# EAGLE design cactusCup_v2 (EAGLE 8.3.2)
A micro-controller designed to fit into an express card slot and become an integrated part of the computer
COMPANY: ADAFRUIT INDUSTRIES; DRAWN: KTOWN; REV: B
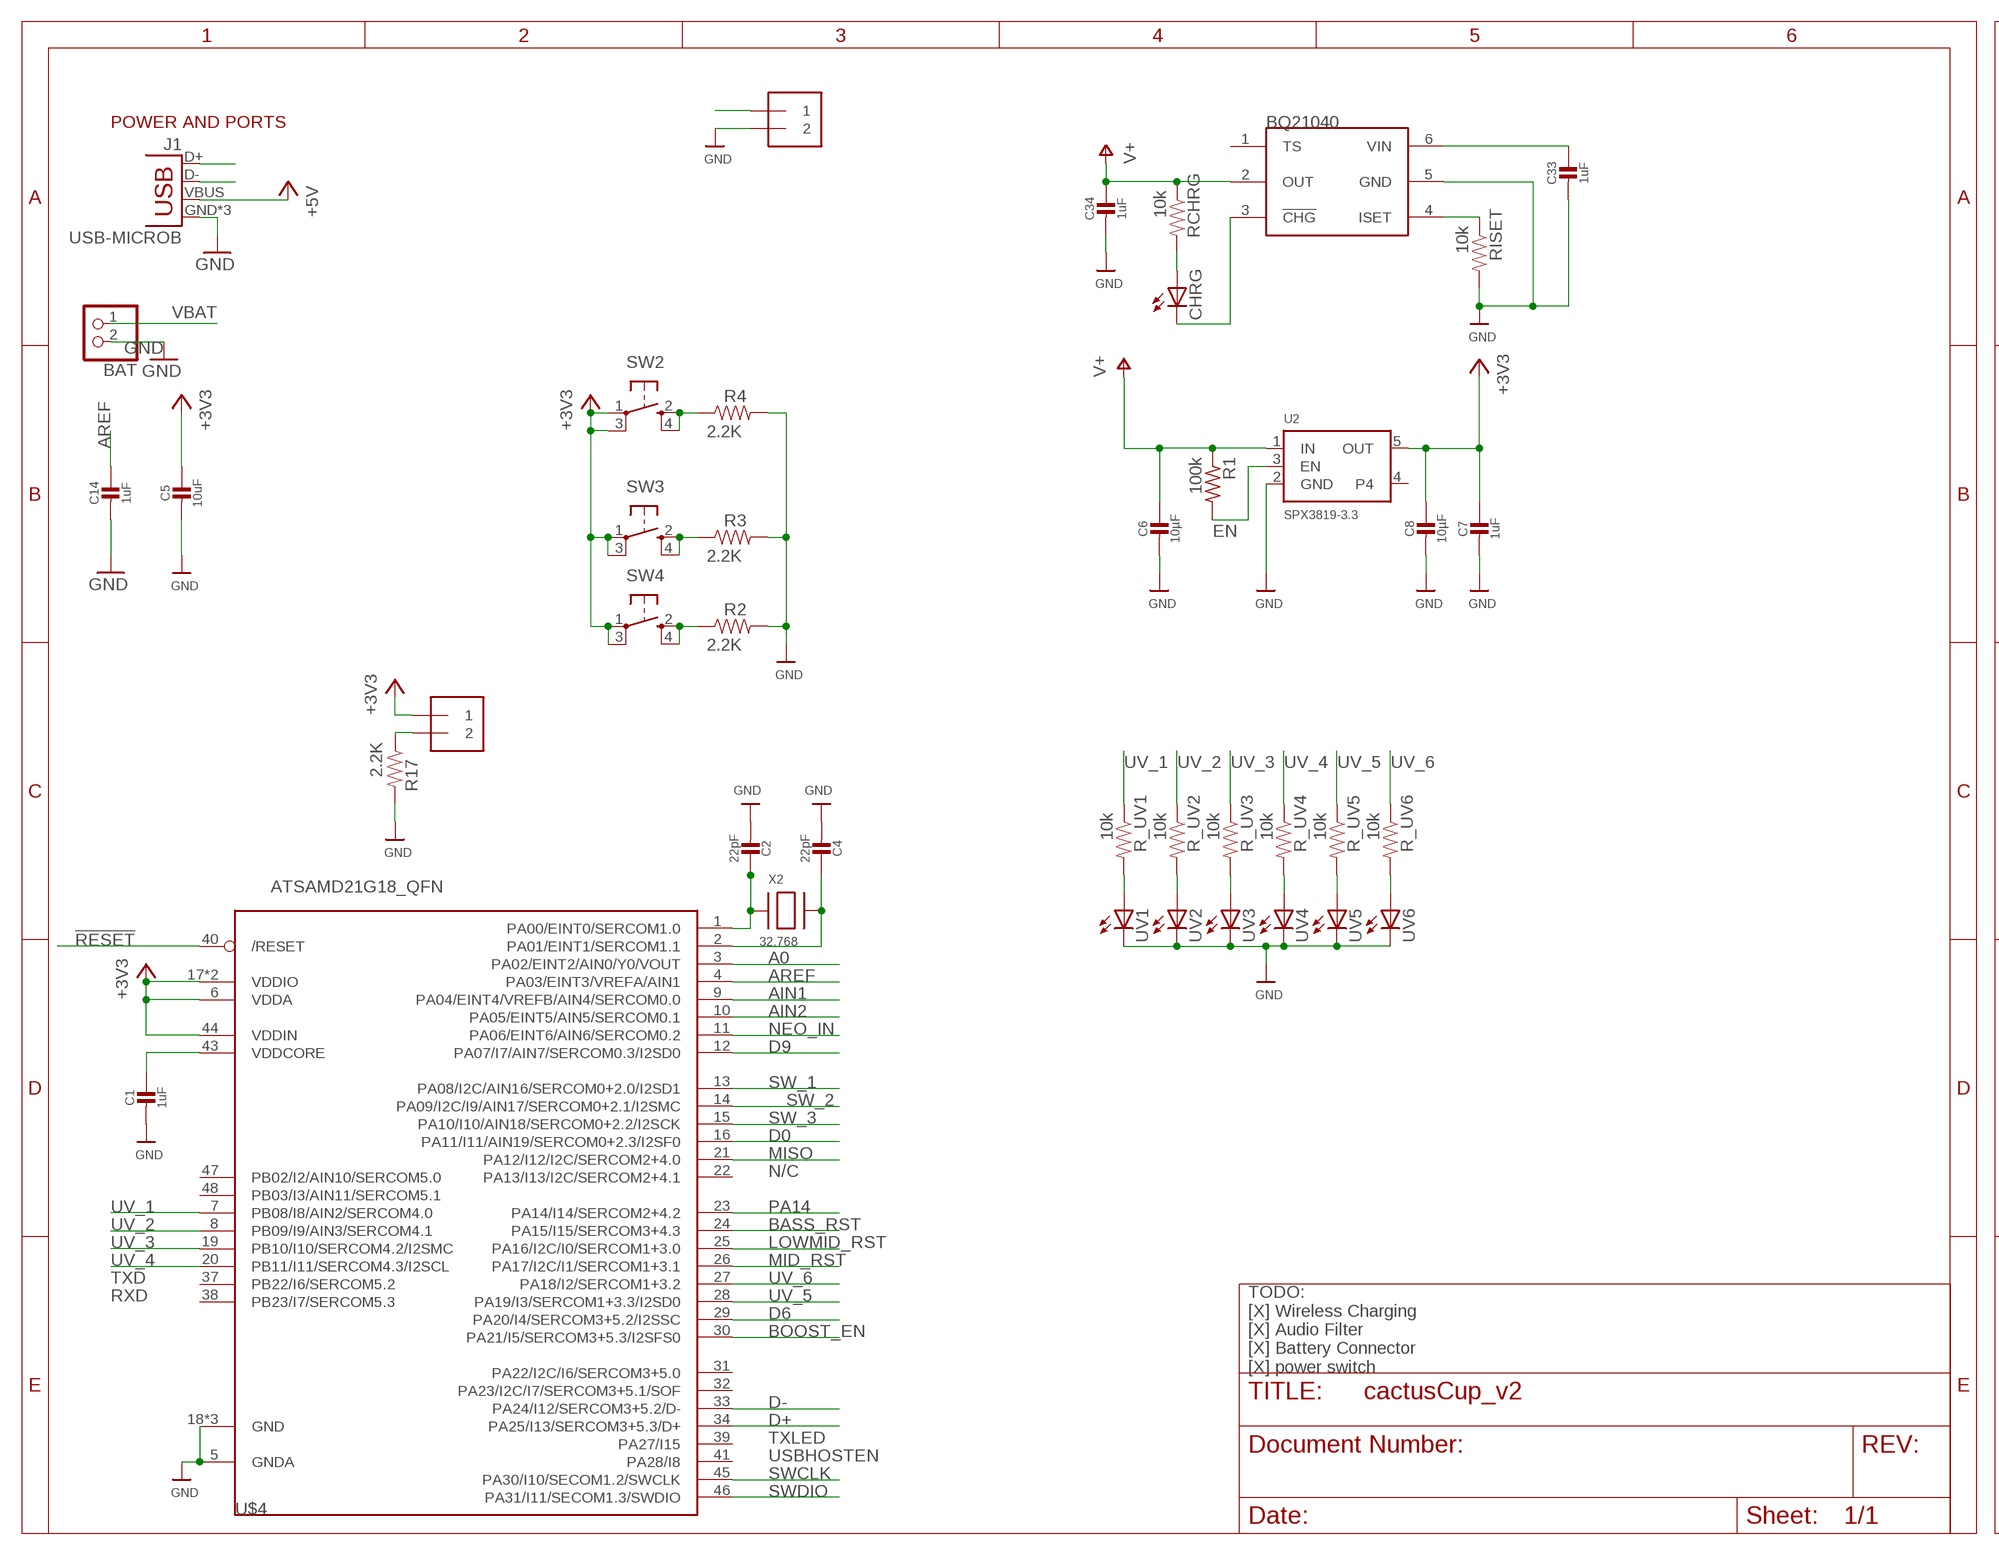
[diagram p0: schematic, sheet 1, part 1 of 2]
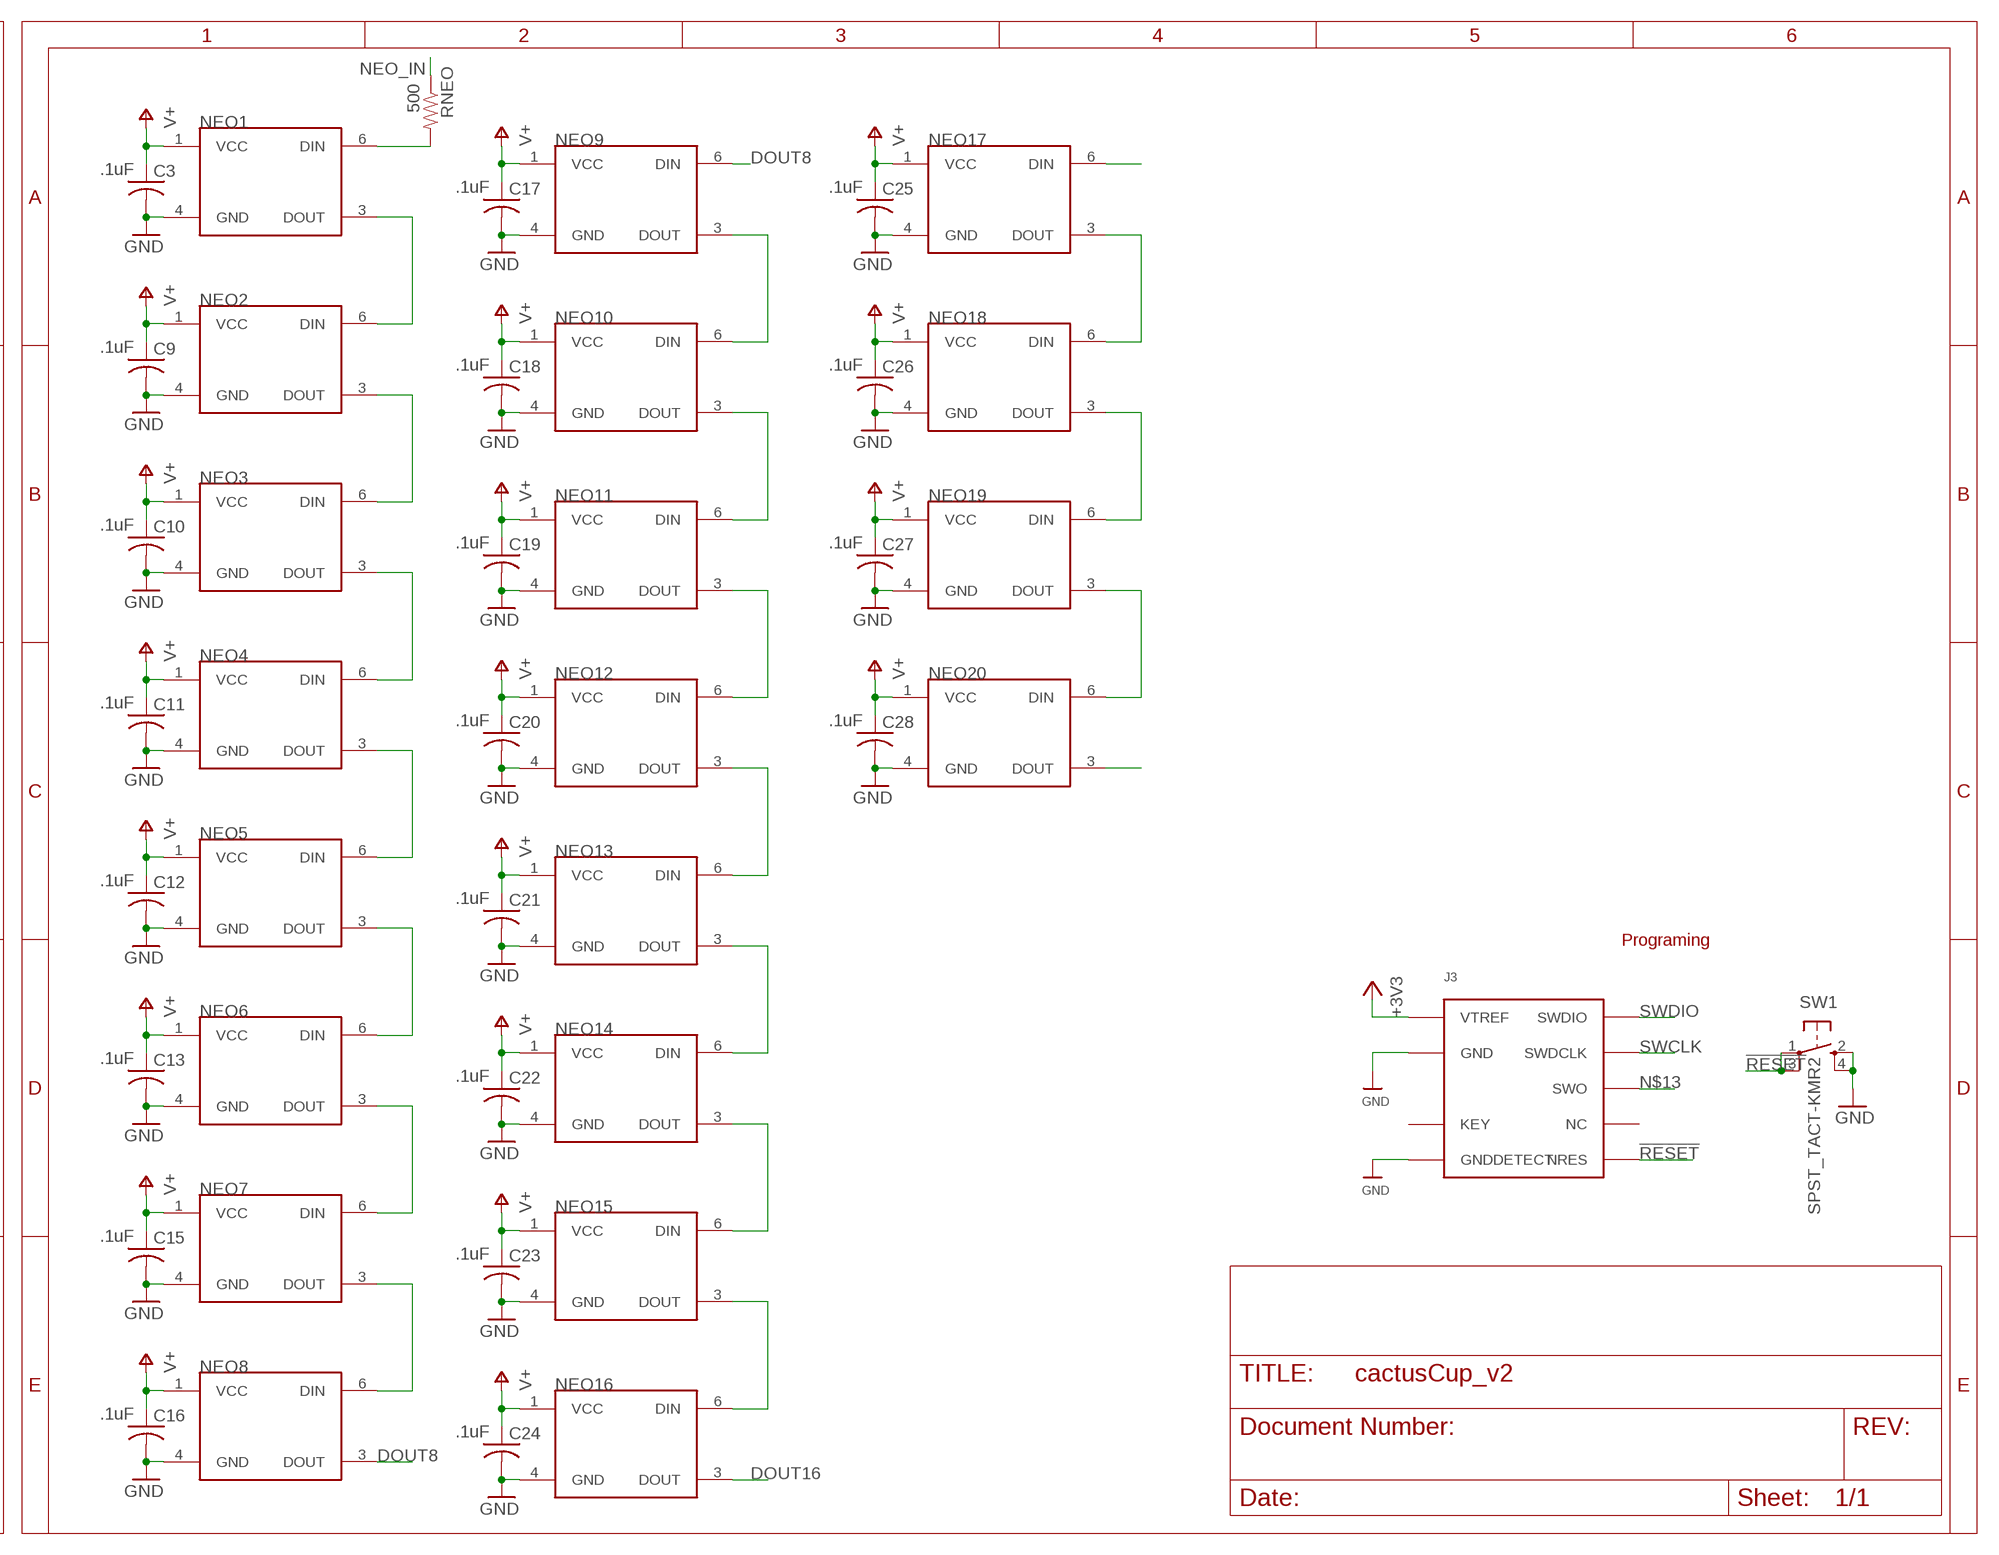
[diagram p1: schematic, sheet 1, part 2 of 2]

## Parts
BAT  JST_2PIN-SMT-RA  [JST-PH-2-SMT-RA]
BQ21040  BQ21040  [SOT23-6]
C1  1uF  CAP_CERAMIC0603_NO  [0603-NO]
C2  22pF  CAP_CERAMIC0603_NO  [0603-NO]
C3  .1uF  C-USC0603  [C0603]
C4  22pF  CAP_CERAMIC0603_NO  [0603-NO]
C5  10uF  CAP_CERAMIC0805-NOOUTLINE  [0805-NO]
C6  10µF  CAP_CERAMIC0805-NOOUTLINE  [0805-NO]
C7  1uF  CAP_CERAMIC0603_NO  [0603-NO]
C8  10µF  CAP_CERAMIC0805-NOOUTLINE  [0805-NO]
C9  .1uF  C-USC0603  [C0603]
C10  .1uF  C-USC0603  [C0603]
C11  .1uF  C-USC0603  [C0603]
C12  .1uF  C-USC0603  [C0603]
C13  .1uF  C-USC0603  [C0603]
C14  1uF  CAP_CERAMIC0603_NO  [0603-NO]
C15  .1uF  C-USC0603  [C0603]
C16  .1uF  C-USC0603  [C0603]
C17  .1uF  C-USC0603  [C0603]
C18  .1uF  C-USC0603  [C0603]
C19  .1uF  C-USC0603  [C0603]
C20  .1uF  C-USC0603  [C0603]
C21  .1uF  C-USC0603  [C0603]
C22  .1uF  C-USC0603  [C0603]
C23  .1uF  C-USC0603  [C0603]
C24  .1uF  C-USC0603  [C0603]
C25  .1uF  C-USC0603  [C0603]
C26  .1uF  C-USC0603  [C0603]
C27  .1uF  C-USC0603  [C0603]
C28  .1uF  C-USC0603  [C0603]
C33  1uF  CAP_CERAMIC0603_NO  [0603-NO]
C34  1uF  CAP_CERAMIC0603_NO  [0603-NO]
CHRG  LEDCHIPLED_0603  [CHIPLED_0603]
J1  USB-MICROB  [USB-MICROB]
J2  1X2-3.5MM  [1X2-3.5MM]
J3  JLINK_10PIN  [FTSH-105-01-F-DH]
J4  1X2-3.5MM  [1X2-3.5MM]
NEO1  NEOPIXEL  [RGBLED5050]
NEO2  NEOPIXEL  [RGBLED5050]
NEO3  NEOPIXEL  [RGBLED5050]
NEO4  NEOPIXEL  [RGBLED5050]
NEO5  NEOPIXEL  [RGBLED5050]
NEO6  NEOPIXEL  [RGBLED5050]
NEO7  NEOPIXEL  [RGBLED5050]
NEO8  NEOPIXEL  [RGBLED5050]
NEO9  NEOPIXEL  [RGBLED5050]
NEO10  NEOPIXEL  [RGBLED5050]
NEO11  NEOPIXEL  [RGBLED5050]
NEO12  NEOPIXEL  [RGBLED5050]
NEO13  NEOPIXEL  [RGBLED5050]
NEO14  NEOPIXEL  [RGBLED5050]
NEO15  NEOPIXEL  [RGBLED5050]
NEO16  NEOPIXEL  [RGBLED5050]
NEO17  NEOPIXEL  [RGBLED5050]
NEO18  NEOPIXEL  [RGBLED5050]
NEO19  NEOPIXEL  [RGBLED5050]
NEO20  NEOPIXEL  [RGBLED5050]
R1  100k  R-US_R0603  [R0603]
R2  2.2K  0.27OHM-1/10W-1%(0603)  [0603-RES]
R3  2.2K  0.27OHM-1/10W-1%(0603)  [0603-RES]
R4  2.2K  0.27OHM-1/10W-1%(0603)  [0603-RES]
R17  2.2K  0.27OHM-1/10W-1%(0603)  [0603-RES]
R_UV1  10k  0.27OHM-1/10W-1%(0603)  [0603-RES]
R_UV2  10k  0.27OHM-1/10W-1%(0603)  [0603-RES]
R_UV3  10k  0.27OHM-1/10W-1%(0603)  [0603-RES]
R_UV4  10k  0.27OHM-1/10W-1%(0603)  [0603-RES]
R_UV5  10k  0.27OHM-1/10W-1%(0603)  [0603-RES]
R_UV6  10k  0.27OHM-1/10W-1%(0603)  [0603-RES]
RCHRG  10k  0.27OHM-1/10W-1%(0603)  [0603-RES]
RISET  10k  0.27OHM-1/10W-1%(0603)  [0603-RES]
RNEO  500  0.27OHM-1/10W-1%(0603)  [0603-RES]
SW1  SPST_TACT-KMR2  [KMR2]
SW2  SPST_TACT-KMR2  [KMR2]
SW3  SPST_TACT-KMR2  [KMR2]
SW4  SPST_TACT-KMR2  [KMR2]
U2  SPX3819-3.3  VREG_SOT23-5  [SOT23-5]
U$4  ATSAMD21G18_QFN  ATSAMD21J  [TQFP48]
UV1  LEDCHIPLED_0603  [CHIPLED_0603]
UV2  LEDCHIPLED_0603  [CHIPLED_0603]
UV3  LEDCHIPLED_0603  [CHIPLED_0603]
UV4  LEDCHIPLED_0603  [CHIPLED_0603]
UV5  LEDCHIPLED_0603  [CHIPLED_0603]
UV6  LEDCHIPLED_0603  [CHIPLED_0603]
X2  32.768  XTAL-3.2X1.5  [XTAL3215]

## Nets
!RESET: J3.10(NRES) SW1.1(P) SW1.3(P1) U$4.40(/RESET)
+3V3: C5.1 C7.1 C8.1 J2.1 J3.1(VTREF) SW2.1(P) SW2.3(P1) SW3.1(P) SW3.3(P1) SW4.1(P) SW4.3(P1) U2.5(OUT) U$4.6(VDDA) U$4.17(VDDIO) U$4.36(VDDIO) U$4.44(VDDIN)
A0: U$4.3(PA02/EINT2/AIN0/Y0/VOUT)
AIN1: U$4.9(PA04/EINT4/VREFB/AIN4/SERCOM0.0)
AIN2: U$4.10(PA05/EINT5/AIN5/SERCOM0.1)
AREF: C14.1 U$4.4(PA03/EINT3/VREFA/AIN1)
BASS_RST: U$4.24(PA15/I15/SERCOM3+4.3)
BOOST_EN: U$4.30(PA21/I5/SERCOM3+5.3/I2SFS0)
D0: U$4.16(PA11/I11/AIN19/SERCOM0+2.3/I2SF0)
D6: J2.2 R17.1 U$4.29(PA20/I4/SERCOM3+5.2/I2SSC)
D9: U$4.12(PA07/I7/AIN7/SERCOM0.3/I2SD0)
D+: J1.D+ U$4.34(PA25/I13/SERCOM3+5.3/D+)
D-: J1.D- U$4.33(PA24/I12/SERCOM3+5.2/D-)
DOUT8: NEO8.3(DOUT) NEO9.6(DIN)
DOUT16: NEO16.3(DOUT) NEO17.6(DIN)
EN: R1.2 U2.3(EN)
GND: BAT.2 BQ21040.5(GND) C1.2 C2.2 C3.2 C4.2 C5.2 C6.2 C7.2 C8.2 C9.2 C10.2 C11.2 C12.2 C13.2 C14.2 C15.2 C16.2 C17.2 C18.2 C19.2 C20.2 C21.2 C22.2 C23.2 C24.2 C25.2 C26.2 C27.2 C28.2 C33.2 C34.2 J1.GND J1.MT1(GND) J1.MT2(GND) J3.3(GND) J3.5(GND) J3.9(GNDDETECT) J4.2 NEO1.4(GND) NEO2.4(GND) NEO3.4(GND) NEO4.4(GND) NEO5.4(GND) NEO6.4(GND) NEO7.4(GND) NEO8.4(GND) NEO9.4(GND) NEO10.4(GND) NEO11.4(GND) NEO12.4(GND) NEO13.4(GND) NEO14.4(GND) NEO15.4(GND) NEO16.4(GND) NEO17.4(GND) NEO18.4(GND) NEO19.4(GND) NEO20.4(GND) R2.2 R3.2 R4.2 R17.2 RISET.2 SW1.2(S) SW1.4(S1) U2.2(GND) U$4.5(GNDA) U$4.18(GND) U$4.35(GND) U$4.42(GND) UV1.C UV2.C UV3.C UV4.C UV5.C UV6.C
LOWMID_RST: U$4.25(PA16/I2C/I0/SERCOM1+3.0)
MID_RST: U$4.26(PA17/I2C/I1/SERCOM1+3.1)
MISO: U$4.21(PA12/I12/I2C/SERCOM2+4.0)
N$1: NEO1.3(DOUT) NEO2.6(DIN)
N$2: NEO3.3(DOUT) NEO4.6(DIN)
N$3: NEO2.3(DOUT) NEO3.6(DIN)
N$4: NEO5.3(DOUT) NEO6.6(DIN)
N$5: C2.1 U$4.1(PA00/EINT0/SERCOM1.0) X2.P$1
N$6: NEO7.3(DOUT) NEO8.6(DIN)
N$7: C4.1 U$4.2(PA01/EINT1/SERCOM1.1) X2.P$2
N$8: NEO6.3(DOUT) NEO7.6(DIN)
N$9: NEO4.3(DOUT) NEO5.6(DIN)
N$10: NEO9.3(DOUT) NEO10.6(DIN)
N$11: NEO11.3(DOUT) NEO12.6(DIN)
N$12: NEO10.3(DOUT) NEO11.6(DIN)
N$13: J3.6(SWO)
N$14: NEO13.3(DOUT) NEO14.6(DIN)
N$15: NEO15.3(DOUT) NEO16.6(DIN)
N$16: NEO14.3(DOUT) NEO15.6(DIN)
N$17: NEO12.3(DOUT) NEO13.6(DIN)
N$18: NEO17.3(DOUT) NEO18.6(DIN)
N$19: NEO19.3(DOUT) NEO20.6(DIN)
N$20: NEO18.3(DOUT) NEO19.6(DIN)
N$21: R_UV1.2 UV1.A
N$22: R_UV2.2 UV2.A
N$23: R_UV3.2 UV3.A
N$24: NEO20.3(DOUT)
N$25: CHRG.A RCHRG.2
N$26: BQ21040.3(!CHG) CHRG.C
N$27: BQ21040.4(ISET) RISET.1
N$28: NEO1.6(DIN) RNEO.2
N$29: R_UV4.2 UV4.A
N$30: R_UV5.2 UV5.A
N$31: R_UV6.2 UV6.A
NEO_IN: RNEO.1 U$4.11(PA06/EINT6/AIN6/SERCOM0.2)
PA14: U$4.23(PA14/I14/SERCOM2+4.2)
SW_1: R4.1 SW2.2(S) SW2.4(S1) U$4.13(PA08/I2C/AIN16/SERCOM0+2.0/I2SD1)
SW_2: R3.1 SW3.2(S) SW3.4(S1) U$4.14(PA09/I2C/I9/AIN17/SERCOM0+2.1/I2SMC)
SW_3: R2.1 SW4.2(S) SW4.4(S1) U$4.15(PA10/I10/AIN18/SERCOM0+2.2/I2SCK)
SWCLK: J3.4(SWDCLK) U$4.45(PA30/I10/SECOM1.2/SWCLK)
SWDIO: J3.2(SWDIO) U$4.46(PA31/I11/SECOM1.3/SWDIO)
UV_1: R_UV1.1 U$4.7(PB08/I8/AIN2/SERCOM4.0)
UV_2: R_UV2.1 U$4.8(PB09/I9/AIN3/SERCOM4.1)
UV_3: R_UV3.1 U$4.19(PB10/I10/SERCOM4.2/I2SMC)
UV_4: R_UV4.1 U$4.20(PB11/I11/SERCOM4.3/I2SCL)
UV_5: R_UV5.1 U$4.28(PA19/I3/SERCOM1+3.3/I2SD0)
UV_6: R_UV6.1 U$4.27(PA18/I2/SERCOM1+3.2)
VBAT: BAT.1 BQ21040.2(OUT) C3.1 C6.1 C9.1 C10.1 C11.1 C12.1 C13.1 C15.1 C16.1 C17.1 C18.1 C19.1 C20.1 C21.1 C22.1 C23.1 C24.1 C25.1 C26.1 C27.1 C28.1 C34.1 NEO1.1(VCC) NEO2.1(VCC) NEO3.1(VCC) NEO4.1(VCC) NEO5.1(VCC) NEO6.1(VCC) NEO7.1(VCC) NEO8.1(VCC) NEO9.1(VCC) NEO10.1(VCC) NEO11.1(VCC) NEO12.1(VCC) NEO13.1(VCC) NEO14.1(VCC) NEO15.1(VCC) NEO16.1(VCC) NEO17.1(VCC) NEO18.1(VCC) NEO19.1(VCC) NEO20.1(VCC) R1.1 RCHRG.1 U2.1(IN) ; supply symbol labelled V+
VBUS: BQ21040.6(VIN) C33.1 J4.1
VDDCORE: C1.1 U$4.43(VDDCORE)
VUSB: J1.VBUS ; supply symbol labelled +5V
Unconnected: BQ21040.1(TS) J3.7(KEY) J3.8(NC) U2.4 U$4.22(PA13/I13/I2C/SERCOM2+4.1) U$4.31(PA22/I2C/I6/SERCOM3+5.0) U$4.32(PA23/I2C/I7/SERCOM3+5.1/SOF) U$4.37(PB22/I6/SERCOM5.2) U$4.38(PB23/I7/SERCOM5.3) U$4.39(PA27/I15) U$4.41(PA28/I8) U$4.47(PB02/I2/AIN10/SERCOM5.0) U$4.48(PB03/I3/AIN11/SERCOM5.1)

## Notes on the sheet
- POWER AND PORTS
- Programing
- N/C
- TXD
- RXD
- TODO:
  [X] Wireless Charging
  [X] Audio Filter
  [X] Battery Connector
  [X] power switch
- TXLED
- USBHOSTEN

## Library data of the parts
BAT = adafruit:JST_2PIN: JST 2-Pin Connectors of various flavors SMT-RA (S2B-PH-SM4) 4UConnector #17311 SMT (B2B-PH-SM4) THM-RA (S2B-PH) THM (B2B-PH)
BQ21040 = cactuscup:BQ21040
C1 C2 C4-C8 C14 C33 C34 = microbuilder:CAP_CERAMIC: Ceramic Capacitors For new designs, use the packages preceded by an '_' character since they are more reliable: The following footprints should be used on most boards: _0402 - Standard footprint for regular board layouts _0603 - Standard footprint for regular board layouts _0805 - Standard footprint for regular board layouts _1206 - Standard footprint for regular board layouts For extremely tight-pitch boards where space is at a premium, the following 'micro-pitch' footprints can be used (smaller pads, no silkscreen outline, etc.): _0402MP - Micro-pitch footprint for very dense/compact boards _0603MP - Micro-pitch footprint for very dense/compact boards _0805MP - Micro-pitch footprint for very dense/compact boards _1206MP - Micro-pitch footprint for very dense/compact boards
C3 C9-C13 C15-C28 = adafruit:C-US: CAPACITOR, American symbol
CHRG UV1-UV6 = led:LED: LED OSRAM: - CHIPLED LG R971, LG N971, LY N971, LG Q971, LY Q971, LO R971, LY R971 LH N974, LH R974 LS Q976, LO Q976, LY Q976 LO Q996 - Hyper CHIPLED LW Q18S LB Q993, LB Q99A, LB R99A - SideLED LS A670, LO A670, LY A670, LG A670, LP A670 LB A673, LV A673, LT A673, LW A673 LH A674 LY A675 LS A676, LA A676, LO A676, LY A676, LW A676 LS A679, LY A679, LG A679 - Hyper Micro SIDELED® LS Y876, LA Y876, LO Y876, LY Y876 LT Y87S - SmartLED LW L88C, LW L88S LB L89C, LB L89S, LG L890 LS L89K, LO L89K, LY L89K LS L896, LA L896, LO L896, LY L896 - TOPLED LS T670, LO T670, LY T670, LG T670, LP T670 LSG T670, LSP T670, LSY T670, LOP T670, LYG T670 LG T671, LOG T671, LSG T671 LB T673, LV T673, LT T673, LW T673 LH T674 LS T676, LA T676, LO T676, LY T676, LB T676, LH T676, LSB T676, LW T676 LB T67C, LV T67C, LT T67C, LS T67K, LO T67K, LY T67K, LW E67C LS E67B, LA E67B, LO E67B, LY E67B, LB E67C, LV E67C, LT E67C LW T67C LS T679, LY T679, LG T679 LS T770, LO T770, LY T770, LG T770, LP T770 LB T773, LV T773, LT T773, LW T773 LH T774 LS E675, LA E675, LY E675, LS T675 LS T776, LA T776, LO T776, LY T776, LB T776 LHGB T686 LT T68C, LB T68C - Hyper Mini TOPLED® LB M676 - Mini TOPLED Santana® LG M470 LS M47K, LO M47K, LY M47K Source: http://www.osram.convergy.de LUXEON: - LUMILED® LXK2-PW12-R00, LXK2-PW12-S00, LXK2-PW14-U00, LXK2-PW14-V00 LXK2-PM12-R00, LXK2-PM12-S00, LXK2-PM14-U00 LXK2-PE12-Q00, LXK2-PE12-R00, LXK2-PE12-S00, LXK2-PE14-T00, LXK2-PE14-U00 LXK2-PB12-K00, LXK2-PB12-L00, LXK2-PB12-M00, LXK2-PB14-N00, LXK2-PB14-P00, LXK2-PB14-Q00 LXK2-PR12-L00, LXK2-PR12-M00, LXK2-PR14-Q00, LXK2-PR14-R00 LXK2-PD12-Q00, LXK2-PD12-R00, LXK2-PD12-S00 LXK2-PH12-R00, LXK2-PH12-S00 LXK2-PL12-P00, LXK2-PL12-Q00, LXK2-PL12-R00 Source: www.luxeon.com KINGBRIGHT: KA-3528ASYC Source: www.kingbright.com
J1 = SparkFun-Connectors:USB: USB Connectors USB-B-PTH is fully proven SKU : PRT-00139/CONN-08278 USB-miniB is fully proven SKU : PRT-00587 USB-A-PCB is untested. USB-A-H is throughly reviewed, but untested. Spark Fun Electronics SKU : PRT-00437 USB-B-SMT is throughly reviewed, but untested. Needs silkscreen touching up. USB-A-S has not been used/tested USB-MB-H has not been used/tested USB-MICROB has been used. CONN-09505; PROD_ID: CONN-09505
J2 J4 = adafruit:1X2: 3.5mm Terminal block http://www.ladyada.net/library/pcb/eaglelibrary.html
J3 = expresscard:JLINK_10PIN
NEO1-NEO20 = cactuscup:NEOPIXEL
R1 = adafruit:R-US_: RESISTOR, American symbol
R2-R4 R17 R_UV1-R_UV6 RCHRG RISET RNEO = SparkFun-Resistors:0.27OHM-1/10W-1%(0603): RES-08787; PROD_ID: RES-08787
SW1-SW4 = adafruit:SPST_TACT: SMT 6mm switch, EVQQ2 series http://www.ladyada.net/library/eagle
U2 = microbuilder:VREG_SOT23-5: SOT23-5 Fixed Voltage Regulators Part Current Out V Out V In V Dropout θJA (°C/W) TJ (°C) Digikey Part No. ADP121 150mA 3.3V 3.4-5.5V 0.09V @ 150mA -- -- ADP121-AUJZ33R7CT-ND ADP121 150mA 3.0V 3.1-5.5V 0.09V @ 150mA -- -- ADP121-AUJZ30R7CT-ND ADP122 300mA 3.3V 3.4-5.5V 0.085V @ 300mA -- -- ADP122AUJZ-3.3-R7CT-ND ADP1712 300mA 3.3V 3.5-5.5V 0.17V @ 300mA -- -- ADP1712AUJZ-3.3-R7TR-ND AP7311 (Low Cost) 150mA 3.3V 3.5-6V 0.15V @ 150mA -- -- AP7311-33WG-7DICT-ND LD39015M18R 150mA 1.8V 1.9V-5.5V 0.08V @ 100mA -- -- 497-6977-1-ND LP2985A-33DBVR 150mA 3.3V 3.3-16V 0.28V @ 150mA 206 150 296-18479-1-ND MCP1824T-3302E/OT 300mA 3.3V 3.5V-6V 0.2V @ 300mA -- -- MCP1824T-3302E/OTCT-ND MIC5205-2.5YM5 TR 150mA 2.5V 2.7-16V 0.165V @ 150mA -- -- 576-1257-2-ND MIC5205-3.0YM5 TR 150mA 3.0V 3.2V-16V 0.165V @ 150mA -- -- 576-1258-2-ND MIC5205-3.3YM5 TR 150mA 3.3V 3.5V-16V 0.165V @ 150mA -- -- 576-1259-2-ND TPS780330220 150mA 3.3V+2.2V 3.6-5.5V 250mV Max -- -- 296-23332-1-ND TDA3663/N1,135 100mA 3.3V 3.5-45V 0.18V @ 50mA -- -- 568-5343-1-ND Max operating temp can be calculated using θJA, TJ (max junction temperature), and power in watts. Set the "Maximum Ambient Temperature" until it reaches TJ ("Max Junction Temperature"), which is the absolute limit for safe use of the regulator: Heat Sink Temperature Calculator <http://www.daycounter.com/Calculators/Heat-Sink-Temperature-Calculator.phtml> For example, With 12V source into a 3.3V LP2985 and a 30mA load, we are dissipating (12V-3.3V) * 0.03A = 0.261W. With a θJA of 206 °C/W, a TJ of 150°C, and 261mW we can safely use the chip without a heat sink up to 75°C (=147.1°C Junction Temperature).
U$4 = con-customer:ATSAMD21J
X2 = adafruit2:XTAL: Low cost SMT crystals, no capacitors included http://www.ladyada.net/library/eagle

## Board
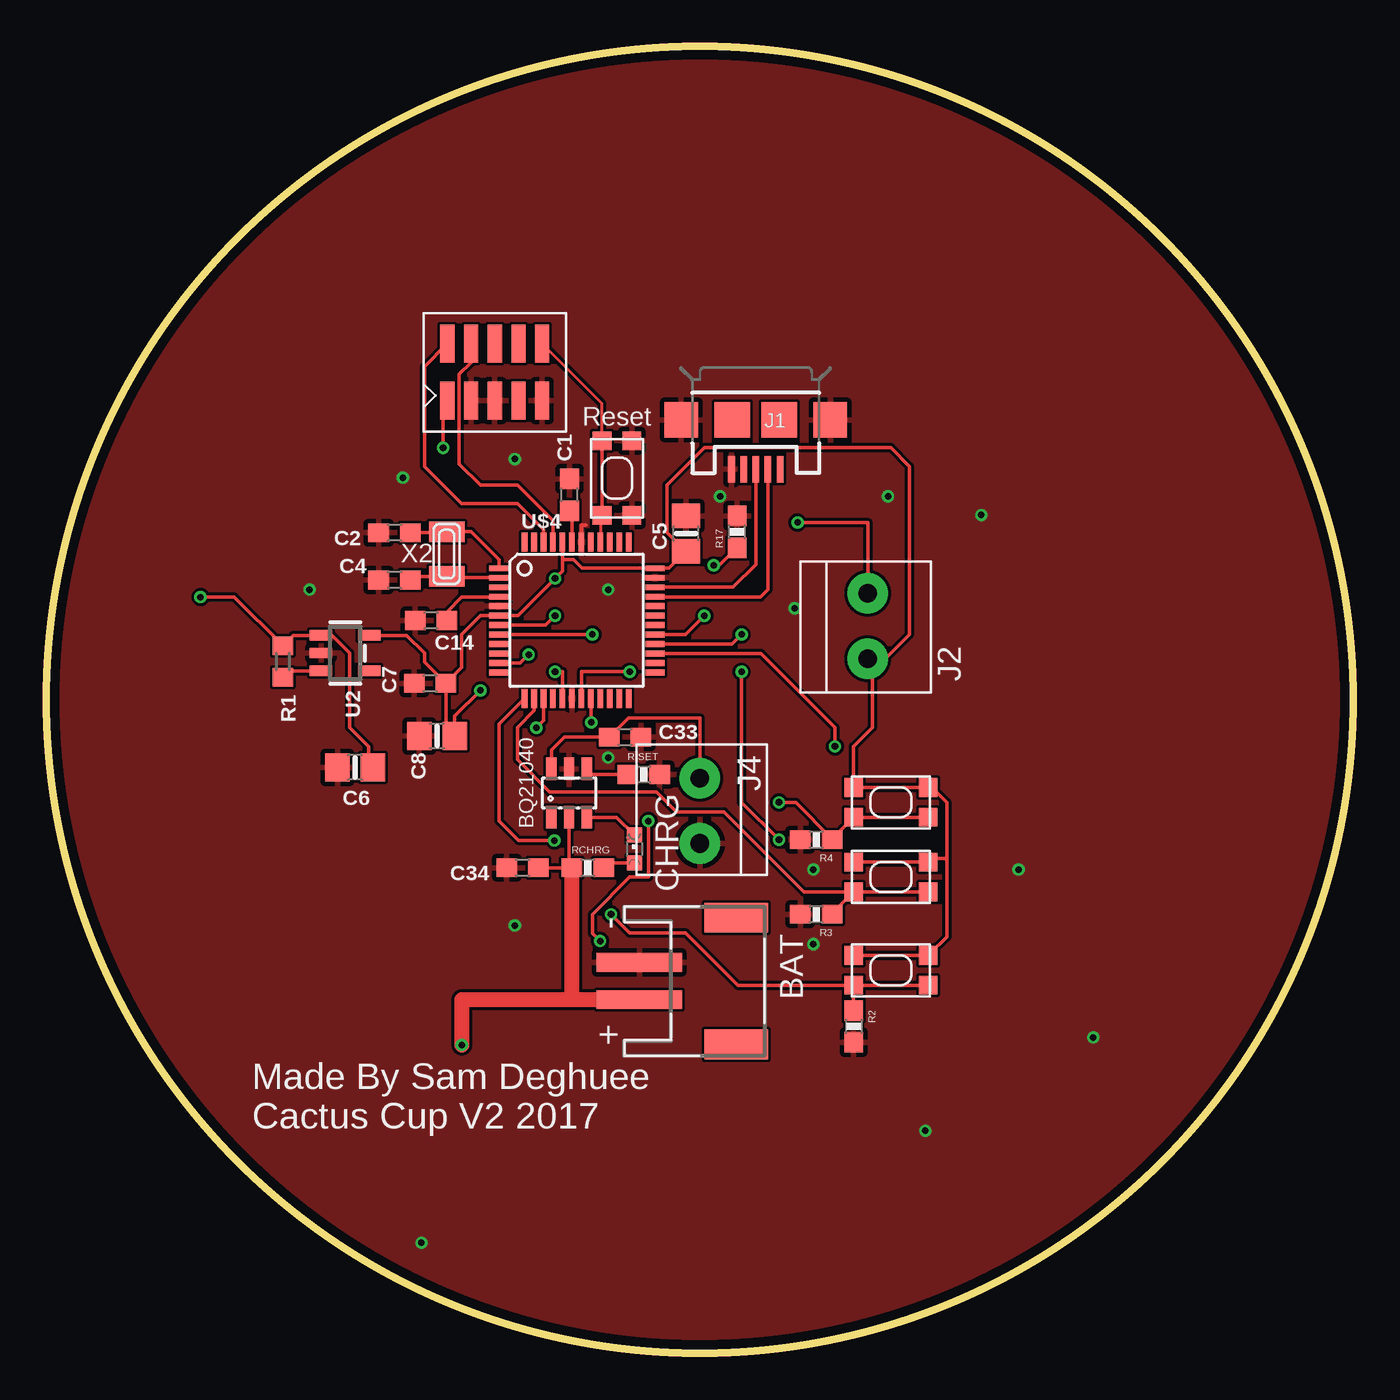
[diagram p2: board, top side]
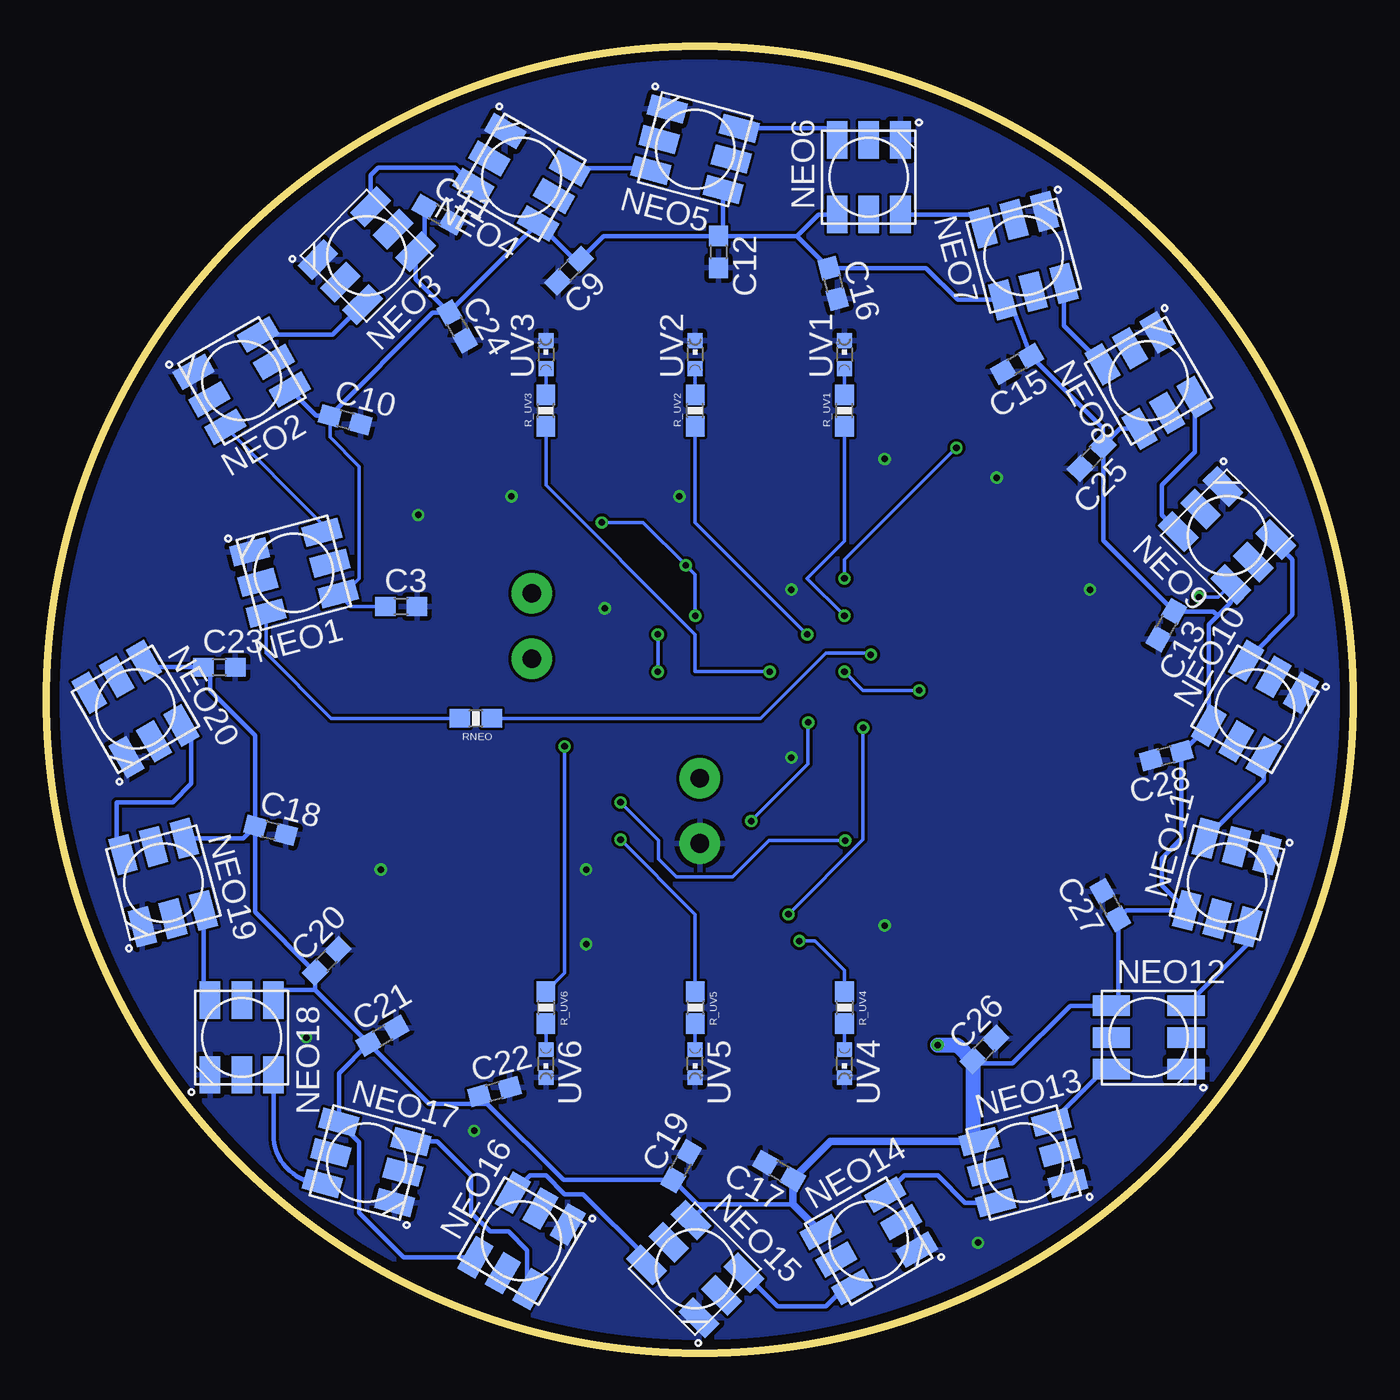
[diagram p3: board, bottom side, seen from below]

Size 70 x 70 mm. Coordinates in mm from the lower left corner, seen from the top.
Outline: circle at 35,35 radius 35
Copper layers (1*16): Top 0.035mm / dielectric 1.6mm / Bottom 0.035mm
Design rules "Elecrow_2-layer_PCB_eagle_rule": minimum track width 6mil, minimum drill 12mil, track to track 6mil, track to pad 6mil, pad to pad 6mil, via to via 8mil, smd to smd 0mil, copper to edge 20mil, drill to drill 10mil, minimum pad ring 6mil, minimum via ring 6mil, stop-mask expansion 0mil, vias tented up to drill 100mil, thermal gap 10mil

### Footprints (pad centres in the part's own frame; a part is rotated, then mirrored left to right if it is on the bottom)
JST-PH-2-SMT-RA = smd 1 x 4.6: 1 1,-3.7; 2 -1,-3.7 | smd 1.6 x 3.4: NC1 -3.4,1.5; NC2 3.4,1.5
SOT23-6 = smd 0.55 x 1.2: 1 -0.95,-1.3; 2 0,-1.3; 3 0.95,-1.3; 4 0.95,1.3; 5 0,1.3; 6 -0.95,1.3
0603-NO = smd 1.1 x 1: 1 -0.85,0; 2 0.85,0
C0603 = smd 1.1 x 1: 1 -0.85,0; 2 0.85,0
0805-NO = smd 1.3 x 1.5: 1 -0.95,0; 2 0.95,0
CHIPLED_0603 = smd 0.8 x 0.8: A 0,-0.75; C 0,0.75
USB-MICROB = smd 0.35 x 1.4: D+ 0,2.65; D- -0.65,2.65; GND 1.3,2.65; ID 0.65,2.65; VBUS -1.3,2.65 | smd 1.8 x 1.9: MT1 -4,0; MT2 4,0 | smd 1.9 x 1.9: P$1 -1.27,0; P$2 1.27,0
1X2-3.5MM = drill 1 pad 2.184: 1 1.8,0; 2 -1.7,0
FTSH-105-01-F-DH = smd 0.76 x 2.03: 1 2.54,1.525; 2 2.54,-1.525; 3 1.27,1.525; 4 1.27,-1.525; 5 0,1.525; 6 0,-1.525; 7 -1.27,1.525; 8 -1.27,-1.525; 9 -2.54,1.525; 10 -2.54,-1.525
RGBLED5050 = smd 2 x 1.1: 1 -2,1.7; 2 -2,0; 3 -2,-1.7; 4 2,-1.7; 5 2,0; 6 2,1.7
R0603 = smd 1 x 1.1: 1 -0.85,0; 2 0.85,0
0603-RES = smd 1.1 x 1: 1 -0.85,0; 2 0.85,0
KMR2 = smd 1 x 1: 1 2,0.8; 2 2,-0.8; 3 -2,0.8; 4 -2,-0.8
SOT23-5 = smd 0.55 x 1.2: 1 -0.95,-1.3; 2 0,-1.3; 3 0.95,-1.3; 4 0.95,1.3; 5 -0.95,1.3
TQFP48 = smd 1.016 x 0.305: 1 -4.191,2.794; 2 -4.191,2.286; 3 -4.191,1.778; 4 -4.191,1.27; 5 -4.191,0.762; 6 -4.191,0.254; 7 -4.191,-0.254; 8 -4.191,-0.762; 9 -4.191,-1.27; 10 -4.191,-1.778; 11 -4.191,-2.286; 12 -4.191,-2.794; 25 4.191,-2.794; 26 4.191,-2.286; 27 4.191,-1.778; 28 4.191,-1.27; 29 4.191,-0.762; 30 4.191,-0.254; 31 4.191,0.254; 32 4.191,0.762; 33 4.191,1.27; 34 4.191,1.778; 35 4.191,2.286; 36 4.191,2.794 | smd 0.305 x 1.016: 13 -2.794,-4.191; 14 -2.286,-4.191; 15 -1.778,-4.191; 16 -1.27,-4.191; 17 -0.762,-4.191; 18 -0.254,-4.191; 19 0.254,-4.191; 20 0.762,-4.191; 21 1.27,-4.191; 22 1.778,-4.191; 23 2.286,-4.191; 24 2.794,-4.191; 37 2.794,4.191; 38 2.286,4.191; 39 1.778,4.191; 40 1.27,4.191; 41 0.762,4.191; 42 0.254,4.191; 43 -0.254,4.191; 44 -0.762,4.191; 45 -1.27,4.191; 46 -1.778,4.191; 47 -2.286,4.191; 48 -2.794,4.191
XTAL3215 = smd 1.1 x 1.9: P$1 1.2,0; P$2 -1.2,0

### Placement (x,y rotation side)
BAT  35.46,19.92 270 top
BQ21040  28,30 0 top
C1  28.02,45.99 90 top
C2  18.64,43.95 180 top
C3  51,40 0 bottom
C4  18.64,41.41 180 top
C5  34.26,43.9 90 top
C6  16.53,31.38 180 top
C7  20.55,35.88 180 top
C8  20.92,33.05 180 top
C9  42,58 225 bottom
C10  54,50 345 bottom
C11  49,61 330 bottom
C12  34,59 270 bottom
C13  10,39 240 bottom
C14  20.61,39.25 180 top
C15  18,53 210 bottom
C16  27.85,57.31 285 bottom
C17  30.74,9.75 150 bottom
C18  58,28 345 bottom
C19  36,10 60 bottom
C20  55,21 45 bottom
C21  52,17 30 bottom
C22  46,14 15 bottom
C23  60.74,36.75 0 bottom
C24  48,55 300 bottom
C25  14,48 225 bottom
C26  19.75,16.26 45 bottom
C27  13,24 120 bottom
C28  10,32 195 bottom
C33  31,33 0 top
C34  25.5,26 180 top
CHRG  31.5,27 0 top
J1  38,50 180 top
J2  44,39 270 top
J3  24.01,52.56 180 top
J4  35,29 90 top
NEO1  56.75,41.8 195 bottom
NEO2  59.55,52.1 210 bottom
NEO3  52.85,58.8 225 bottom
NEO4  44.55,63 150 bottom
NEO5  35.25,64.5 165 bottom
NEO6  25.95,63 90 bottom
NEO7  17.65,58.8 105 bottom
NEO8  10.95,52.1 120 bottom
NEO9  6.75,43.8 135 bottom
NEO10  5.25,34.5 60 bottom
NEO11  6.75,25.2 75 bottom
NEO12  10.95,16.9 0 bottom
NEO13  17.65,10.2 15 bottom
NEO14  25.95,6 30 bottom
NEO15  35.25,4.5 315 bottom
NEO16  44.55,6 60 bottom
NEO17  52.85,10.2 345 bottom
NEO18  59.55,16.9 270 bottom
NEO19  63.75,25.2 285 bottom
NEO20  65.25,34.5 300 bottom
R1  12.66,37.05 270 top
R2  43.25,17.5 270 top
R3  41.25,23.5 180 top
R4  41.25,27.5 180 top
R17  37,44 90 top
R_UV1  27.25,50.5 90 bottom
R_UV2  35.25,50.5 90 bottom
R_UV3  43.25,50.5 90 bottom
R_UV4  27.25,18.5 270 bottom
R_UV5  35.25,18.5 270 bottom
R_UV6  43.25,18.5 270 bottom
RCHRG  29,26 0 top
RISET  32,31 0 top
RNEO  47,34 180 bottom
SW1  30.56,46.88 90 top
SW2  45.25,29.5 0 top
SW3  45.25,25.5 0 top
SW4  45.25,20.5 0 top
U2  16,37.5 270 top
U$4  28.4,39.26 0 top
UV1  27.25,53.5 0 bottom
UV2  35.25,53.5 0 bottom
UV3  43.25,53.5 0 bottom
UV4  27.25,15.5 180 bottom
UV5  35.25,15.5 180 bottom
UV6  43.25,15.5 180 bottom
X2  21.43,42.81 90 top

### Tracks (layer width: path | path; a pad name or v marks a point on that pad's centre or on a via)
!RESET
  Top 0.152: SW1.1 29.76,50.87 J3.10 | SW1.3 arc90 29.67,44.79 U$4.40
  Top 0.2: SW1.3 SW1.1
+3V3  (via drill 0.35)
  Top 0.2: SW2.1 SW2.3 43.25,32.5 44.25,33.5 44.25,36.95 J2.1 44.95,37.2 46.25,38.5 46.25,47.5 45.25,48.5 35.25,48.5 33.25,46.5 33.25,43.97 C5.1 33.36,42.05 U$4.36 28.7,42.05 28.25,42.5 27.75,42.5 27.64,42.61 | SW3.3 SW3.1 47.45,26.5 48.25,26.5 | 27.64,42.61 U$4.44 | C7.1 22.25,36.72 22.25,38.5 23.25,39.5 24.2,39.5 U$4.6 25.26,39.51 v27.25,41.5 27.64,41.9 27.64,42.61 | C7.1 21.4,33.05 C8.1 21.87,34.13 v23.25,35.5 | U2.5 19.3,38.45 20.25,37.5 20.25,37.03 C7.1 | J3.1 21.25,50.8 v21.25,48.5 | U$4.17 27.64,36.5 v27.25,36.5 | SW2.1 47.45,30.3 | 47.35,21.4 SW4.1 | 47.35,21.4 48.25,22.3 48.25,26.5 | 48.25,26.5 48.25,29.5 47.45,30.3 | 47.45,30.3 SW2.1 | SW4.3 SW4.1 | SW4.1 47.35,21.4
  Bottom 0.2: v21.25,48.5 27.25,42.5 v27.25,41.5 | v27.25,36.5 26.25,35.5 v23.25,35.5
AREF
  Top 0.2: C14.1 21.46,39.71 22.25,40.5 24.19,40.5 U$4.4
D6  (via drill 0.35)
  Top 0.2: U$4.29 34.24,38.49 v35.25,39.5 | v35.75,42.21 36.06,42.21 R17.1 | J2.2 44,44.5 v40.25,44.5
  Bottom 0.2: v35.25,39.5 35.25,41.71 v35.75,42.21 38.04,44.5 v40.25,44.5
D+
  Top 0.2: J1.D+ 38,42.26 36.78,41.03 U$4.34
D-
  Top 0.2: J1.D- 38.65,40.91 38.25,40.5 32.62,40.5 U$4.33
DOUT8
  Bottom 0.254: NEO9.6 10.25,44.9 10.25,46.5 8.47,48.27 NEO8.3
DOUT16
  Bottom 0.254: NEO17.6 49.07,11.33 47.25,9.5 47.25,7.5 46.25,6.5 45.25,6.5 44.25,5.5 44.25,3.59 NEO16.3
EN
  Top 0.2: R1.2 12.66,36.55 U2.3
GND  (via drill 0.35)
  Top 0.2: U$4.42 28.66,44.37 28.9,44.37
  other vias: 30.09,31.9 25.09,22.9 20.09,5.9 47.09,11.9 56.09,16.9 52.09,25.9 50.09,44.9 45.09,45.9 40.09,39.9 14.09,40.9 25.09,47.9 36.09,45.9 41.09,25.9 41.09,21.9 30.09,40.9 19.09,46.9
  pour Top: 109.25,-40.5 109.25,104.5 -38.75,104.5 -38.75,-39.5 -2.75,-39.5
  pour Bottom: -51.75,112.5 108.25,112.5 108.25,-39.5 -51.75,-39.5
N$1
  Bottom 0.2: 55.25,44.46 NEO1.3 55.25,44.46 | NEO2.6 55.25,44.46
N$2
  Bottom 0.254: NEO4.6 48.1,63.5 52.25,63.5 52.63,63.11 NEO3.3
N$3
  Bottom 0.254: NEO3.6 54.67,54.57 NEO2.3
N$4
  Bottom 0.254: NEO6.6 28.27,65.63 NEO5.3
N$5
  Top 0.2: C2.1 21.38,43.96 X2.P$1 22.74,44.01 24.25,42.5 24.25,42.08 U$4.1
N$6
  Bottom 0.254: NEO8.6 15.49,55.05 NEO7.3
N$7
  Top 0.2: U$4.2 21.5,41.54 X2.P$2 19.69,41.61 C4.1
N$8
  Bottom 0.254: NEO7.6 20.51,61 NEO6.3
N$9
  Bottom 0.254: NEO5.6 37.72,63.47 NEO4.3
N$10
  Bottom 0.254: NEO10.6 3.25,39.56 3.25,42.5 4.13,43.39 NEO9.3
N$11
  Bottom 0.254: NEO12.6 5.62,21.93 NEO11.3
N$12
  Bottom 0.254: NEO11.6 4.77,30.67 NEO10.3
N$14
  Bottom 0.254: NEO14.6 24.04,9.5 22.25,9.5 20.79,8.04 NEO13.3
N$15
  Bottom 0.254: NEO16.6 44.1,9.5 43.25,9.5 42.25,8.5 41.25,8.5 37.86,5.12 NEO15.3
N$16
  Bottom 0.254: NEO15.6 30.84,2.5 28.25,2.5 27.22,3.53 NEO14.3
N$17
  Bottom 0.254: NEO13.6 13.31,15.2 NEO12.3
N$18
  Bottom 0.254: NEO18.6 57.85,11.71 arc-90 NEO17.3
N$19
  Bottom 0.254: NEO20.6 62.25,33.09 62.25,30.5 63.25,29.5 66.25,29.5 66.25,27.03 arc-90 NEO19.3
N$20
  Bottom 0.254: NEO19.6 61.59,19.24 arc-90 NEO18.3
N$21
  Bottom 0.2: R_UV1.2 UV1.A
N$22
  Bottom 0.2: R_UV2.2 UV2.A
N$23
  Bottom 0.2: R_UV3.2 UV3.A
N$25
  Top 0.2: CHRG.A 30.1,26.25 RCHRG.2
N$26
  Top 0.2: BQ21040.3 30.55,28.7 CHRG.C
N$27
  Top 0.2: BQ21040.4 29.25,31 RISET.1
N$28
  Bottom 0.2: RNEO.2 54.75,34 58.24,37.49 NEO1.6
N$29
  Bottom 0.2: R_UV4.2 UV4.A
N$30
  Bottom 0.2: R_UV5.2 UV5.A
N$31
  Bottom 0.2: UV6.A R_UV6.2
NEO_IN  (via drill 0.35)
  Top 0.2: v25.83,37.42 25.38,36.97 U$4.11
  Bottom 0.2: RNEO.1 31.75,34 28.25,37.5 25.91,37.5 v25.83,37.42
SW_1  (via drill 0.35)
  Top 0.2: R4.1 42.1,27.55 | 42.1,27.55 SW2.4 SW2.2 | 42.1,27.55 40.15,29.5 v39.25,29.5 | v27.21,27.46 25.29,27.46 24.25,28.5 24.25,33.7 U$4.13
  Bottom 0.2: v39.25,29.5 37.2,27.46 37.2,26.46 36.25,25.5 33.25,25.5 31.29,27.46 v27.21,27.46
SW_2
  Top 0.2: R3.1 42.1,23.55 SW3.4 | SW3.4 SW3.2 | U$4.14 26.12,34.41 25.22,33.52 25.22,31.79 26.96,30.05 32.69,30.05 33.75,29 36.3,29 40.59,24.7 SW3.4
SW_3  (via drill 0.35)
  Top 0.2: R2.1 SW4.4 | SW4.4 SW4.2 | SW4.4 37.05,19.7 34.25,22.5 31.25,22.5 v30.25,23.5 | v26.25,33.5 26.62,33.88 U$4.15
  Bottom 0.2: v30.25,23.5 26.25,27.5 v26.25,33.5
SWCLK
  Top 0.2: U$4.45 27.13,44.61 25.25,46.5 23.25,46.5 22.11,47.63 22.11,52.46 22.74,53.05 J3.4
SWDIO
  Top 0.2: U$4.46 26.62,44.12 25.25,45.5 22.25,45.5 20.25,47.5 20.25,52.85 J3.2
UV_1  (via drill 0.35)
  Top 0.2: v27.25,39.5 26.75,39 U$4.7
  Bottom 0.2: R_UV1.1 27.25,43.5 29.25,41.5 v27.25,39.5
UV_2  (via drill 0.35)
  Top 0.2: v29.25,38.5 U$4.8
  Bottom 0.2: R_UV2.1 35.25,44.5 v29.25,38.5
UV_3  (via drill 0.35)
  Top 0.2: U$4.19 28.66,36.5 v31.25,36.5
  Bottom 0.2: v31.25,36.5 35.25,36.5 35.25,38.5 43.25,46.5 R_UV3.1
UV_4  (via drill 0.35)
  Top 0.2: U$4.20 29.17,33.81 v29.19,33.79 | v32.25,28.5 32.25,25.5 31.25,25.5 29.25,23.5 29.25,22.49 v29.66,22.07
  Bottom 0.2: v29.19,33.79 29.19,31.56 v32.25,28.5 | v29.66,22.07 28.82,22.07 27.25,20.5 R_UV4.1
UV_5  (via drill 0.35)
  Top 0.2: v39.25,27.5 37.25,29.5 v37.25,36.5 | v37.25,38.5 36.73,37.99 U$4.28
  Bottom 0.2: R_UV5.1 35.25,23.5 v39.25,27.5 | v37.25,36.5 v37.25,38.5
UV_6  (via drill 0.35)
  Top 0.2: U$4.27 38.27,37.48 42.25,33.5 v42.25,32.5
  Bottom 0.2: v42.25,32.5 42.25,20.35 R_UV6.1
VBAT  (via drill 0.35)
  Top 0.2: C34.1 RCHRG.1 28,26.15 BQ21040.2 | v8.25,40.5 10.06,40.5 R1.1 13.22,38.45 U2.1 15.3,38.45 16.25,37.5 16.25,33.5 17.25,32.5 17.25,31.61 C6.1
  Top 0.813: BAT.1 28.15,18.92 | 28.15,18.92 RCHRG.1 | 28.15,18.92 22.25,18.92 v22.25,16.5
  Bottom 0.2: v8.25,40.5 7.22,40.5 NEO9.1 | C3.1 53.7,40 NEO1.1 54.07,40.68 53.25,41.5 53.25,47.5 54.82,49.08 C10.1
  Bottom 0.254: NEO2.1 55.56,50.22 C10.1 49.3,55.74 C24.1 | C24.1 50.23,57.54 NEO3.1 49.74,59.51 C11.1 | C24.1 48.43,55.77 NEO4.1 41.74,58.6 C9.1 40.15,59.85 C12.1 | C12.1 33.75,60.1 NEO5.1 | 29.79,59.85 C12.1 | 29.79,59.85 C16.1 22.88,58.13 21.17,56.43 NEO7.1 18.17,55.83 C15.1 13.4,49.56 C25.1 13.37,48.63 | NEO6.1 28.64,61 29.79,59.85 | 13.37,48.63 12.48,49.52 NEO8.1 | 13.37,48.63 13.37,43.53 C13.1 7.48,39.74 7.25,39.5 | 7.25,39.5 6.53,40.21 NEO9.1 | 7.25,39.5 7.72,39.03 NEO10.1 9.12,32.22 C28.1 9.18,27.57 10.25,26.5 10.25,25.05 NEO11.1 12.13,23.71 C27.1 12.58,18.97 NEO12.1 15.15,18.6 18.25,15.5 20.2,15.5 C26.1 | 30.01,7.95 34.62,7.95 | 34.62,7.95 NEO15.1 | 34.62,7.95 35.12,7.95 C19.1 42.3,9.26 46.39,13.35 | 46.39,13.35 C22.1 | NEO16.1 50.86,5.12 53.25,7.5 53.25,11.27 NEO17.1 54.34,14.97 C21.1 | C21.1 49.51,13.35 46.39,13.35 | 55.6,19.44 C21.1 | 55.6,19.44 C20.1 58.82,23.62 C18.1 | NEO18.1 57.31,19.44 55.6,19.44 | C18.1 59.47,27.57 NEO19.1 | C18.1 58.82,33.08 61.25,35.5 61.25,36.4 C23.1 64.44,36.75 NEO20.1
  Bottom 0.406: NEO13.1 28.01,11.33 C17.1 30.01,7.95 NEO14.1
  Bottom 0.813: v22.25,16.5 21.2,16.5 C26.1 20.35,11.66 NEO13.1
VBUS
  Top 0.2: BQ21040.6 27.05,32.31 27.75,33 C33.1 31.17,34.02 35,34.02 J4.1
VDDCORE
  Top 0.2: U$4.43 28.15,45.01 C1.1

### Text on the board
tPlace: Reset
tNames: Made By Sam Deghuee / Cactus Cup V2 2017
_tNames: C12 | X1 | RLED3 | RLED1 | RLED2
_bNames: J1
200bmp: /home/samtopu/Downloads/flat,800x800,070,f.u2.bmp
201bmp: C:/Users/sdegh/Desktop/v7nqiV3q.bmp